# EAGLE design basebotPower (EAGLE 6.5.0)
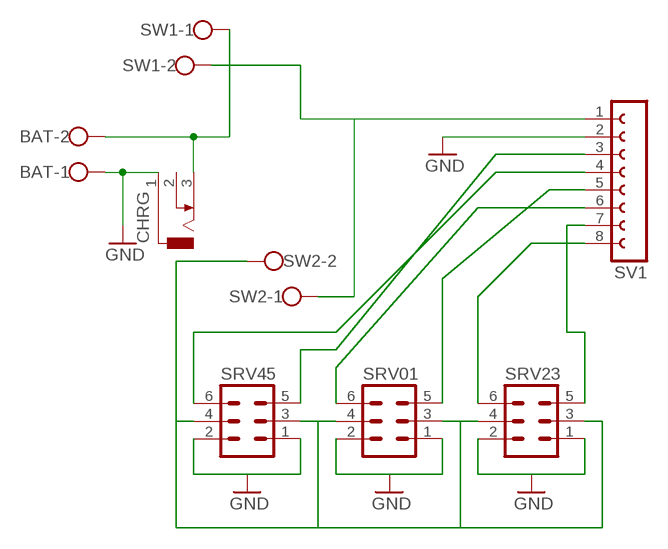
[diagram p0: schematic, sheet 1]

## Parts
BAT  W237-102  [W237-102]
CHRG  DCJ0303  [DCJ0303]
SRV01  MA03-2  [MA03-2]
SRV23  MA03-2  [MA03-2]
SRV45  MA03-2  [MA03-2]
SV1  FE08-1  [FE08]
SW1  W237-102  [W237-102]
SW2  W237-102  [W237-102]

## Nets
GND [power]: BAT.1 CHRG.1 SRV01.1 SRV01.2 SRV23.1 SRV23.2 SRV45.1 SRV45.2 SV1.2
N$2 [power]: BAT.2 CHRG.3 SW1.1
N$3: SRV23.6 SV1.8
N$4: SRV23.5 SV1.7
N$5: SRV45.6 SV1.4
N$6: SRV45.5 SV1.3
N$7: SRV01.6 SV1.6
N$9: SRV01.5 SV1.5
N$12 [power]: SRV01.3 SRV01.4 SRV23.3 SRV23.4 SRV45.3 SRV45.4 SW2.2
SERVOPWR [power]: SV1.1 SW1.2 SW2.1
Unconnected: CHRG.2

## Library data of the parts
BAT SW1 SW2 = con-wago-500:W237-102: WAGO SCREW CLAMP; MPN: 237-102; OC_FARNELL: unknown; OC_NEWARK: 70K9898
CHRG = con-jack:DCJ0303: DC POWER JACK Source: DCJ0303.pdf; OC_FARNELL: unknown; OC_NEWARK: unknown
SRV01 SRV23 SRV45 = con-lstb:MA03-2: PIN HEADER; OC_FARNELL: unknown; OC_NEWARK: unknown
SV1 = con-lsta:FE08-1: FEMALE HEADER; OC_FARNELL: unknown; OC_NEWARK: unknown

## Net classes
0 default: width 0.254 mm, drill 0.305 mm, clearance 0.254 mm
1 power: width 0.635 mm, drill 0.305 mm, clearance 0.508 mm

## Board
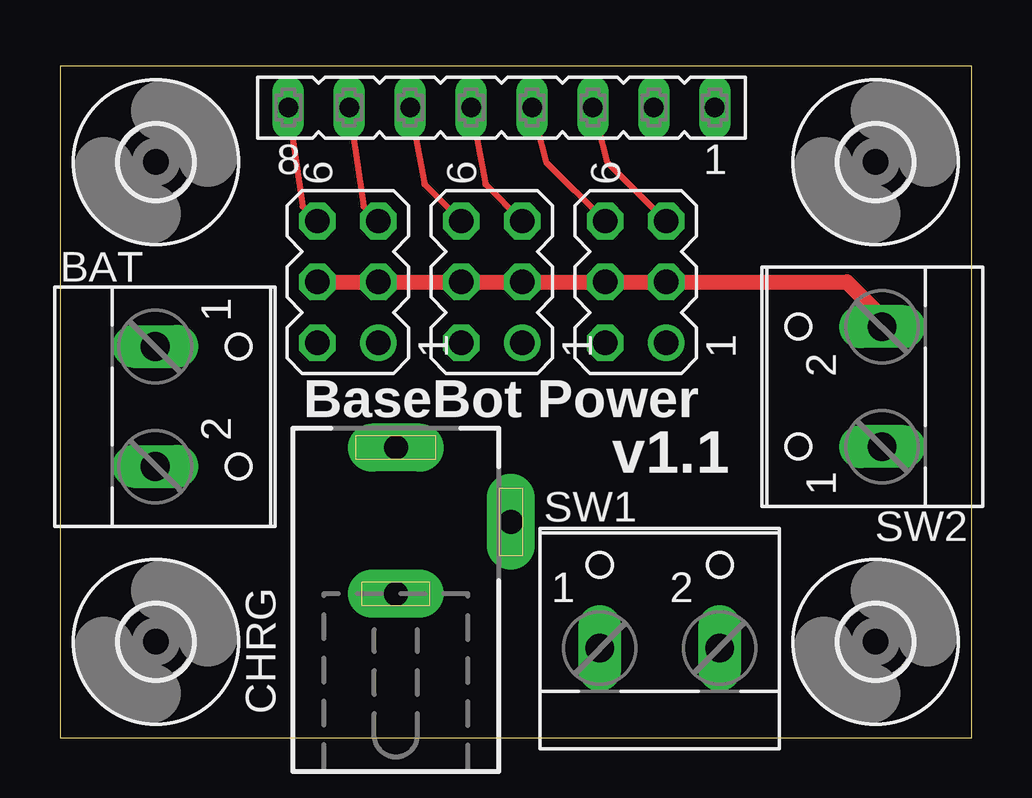
[diagram p1: board, top side]
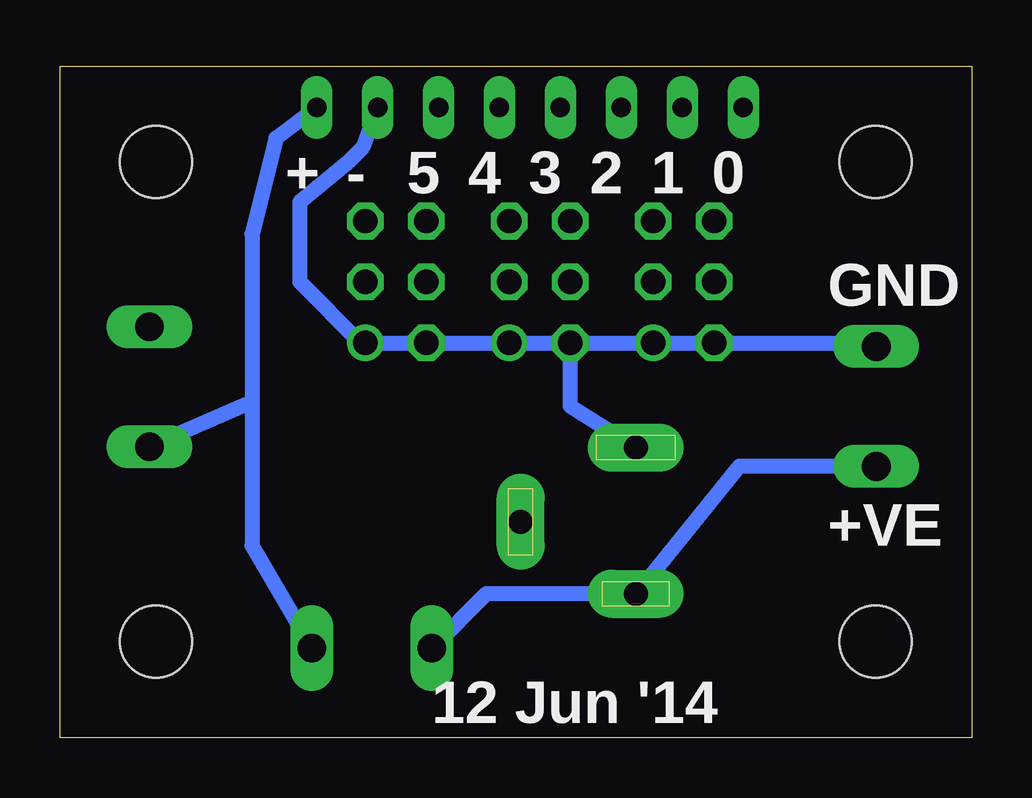
[diagram p2: board, bottom side, seen from below]

Size 38 x 28 mm. Coordinates in mm from the lower left corner, seen from the top.
Outline: 0,0 38,0 38,28 0,28 0,0
Copper layers (1*16): Top 0.035mm / dielectric 1.5mm / Bottom 0.035mm
Design rules "default": minimum track width 10mil, minimum drill 24mil, track to track 8mil, track to pad 8mil, pad to pad 8mil, via to via 8mil, smd to smd 8mil, copper to edge 40mil, drill to drill 8mil, minimum pad ring 10mil, minimum via ring 8mil, stop-mask expansion 4mil, vias tented up to drill 0mil, thermal gap 10mil

### Footprints (pad centres in the part's own frame; a part is rotated, then mirrored left to right if it is on the bottom)
W237-102 = drill 1.194 long: 1 -2.5,-1.27; 2 2.5,-1.27
DCJ0303 = drill 1 pad 2 long: 1 0,3.1; 2 4.8,0; 3 0,-3
MA03-2 = drill 1.016: 1 -2.54,-1.27 | drill 1.016 octagon: 2 -2.54,1.27; 3 0,-1.27; 4 0,1.27; 5 2.54,-1.27; 6 2.54,1.27
FE08 = drill 0.813 long: 1 -8.89,0; 2 -6.35,0; 3 -3.81,0; 4 -1.27,0; 5 1.27,0; 6 3.81,0; 7 6.35,0; 8 8.89,0
3,0 = hole 3: 0,0

### Placement (x,y rotation side)
BAT  5.24,13.81 270 top
CHRG  14,9 0 top
SRV01  18,19 90 top
SRV23  12,19 90 top
SRV45  24,19 90 top
SV1  18.41,26.28 180 top
SW1  25,5 0 top
SW2  33,14.63 90 top
U$1  [3,0]  4,4 0 top
U$2  [3,0]  4,24 0 top
U$3  [3,0]  34,4 0 top
U$4  [3,0]  34,24 0 top

### Tracks (layer width: path | path; a pad name or v marks a point on that pad's centre or on a via)
GND
  Bottom 0.254: SRV45.1 25.46,16.46
  Bottom 0.635: SV1.2 25.35,24.65 26,24 28,22.35 28,19 25.46,16.46 | SRV45.1 SRV45.2 SRV01.1 SRV01.2 | SRV01.2 SRV23.1 SRV23.2 4.12,16.46 BAT.1 | SRV01.2 16.73,13.83 CHRG.1
N$2
  Bottom 0.635: BAT.2 9.69,11.31 CHRG.3 20.23,6 SW1.1
N$3
  Top 0.254: SV1.8 10.11,22.16 SRV23.6
N$4
  Top 0.254: SV1.7 12.65,22.16 SRV23.5
N$5
  Top 0.254: SV1.4 20.27,24 SRV45.6
N$6
  Top 0.254: SV1.3 22.81,24 SRV45.5
N$7
  Top 0.254: SV1.6 15.19,23.08 SRV01.6
N$9
  Top 0.254: SV1.5 17.73,23.08 SRV01.5
N$12
  Top 0.635: SRV23.4 SRV23.3 SRV01.4 SRV01.3 SRV45.4 SRV45.3 32.81,19 34.27,17.54 SW2.2
SERVOPWR
  Bottom 0.635: SV1.1 29,25 30,21 30,14 | 30,14 SW2.1 | 30,14 30,8 SW1.2

### Text on the board
tNames: BaseBot Power | v1.1
bNames: 0 | 1 | 2 | 3 | 4 | 5 | - | + | GND | +VE | 12 Jun '14